# Altium schematic sheet Overview.SchDoc
size A; SheetNumber: 1; SheetTotal: 7
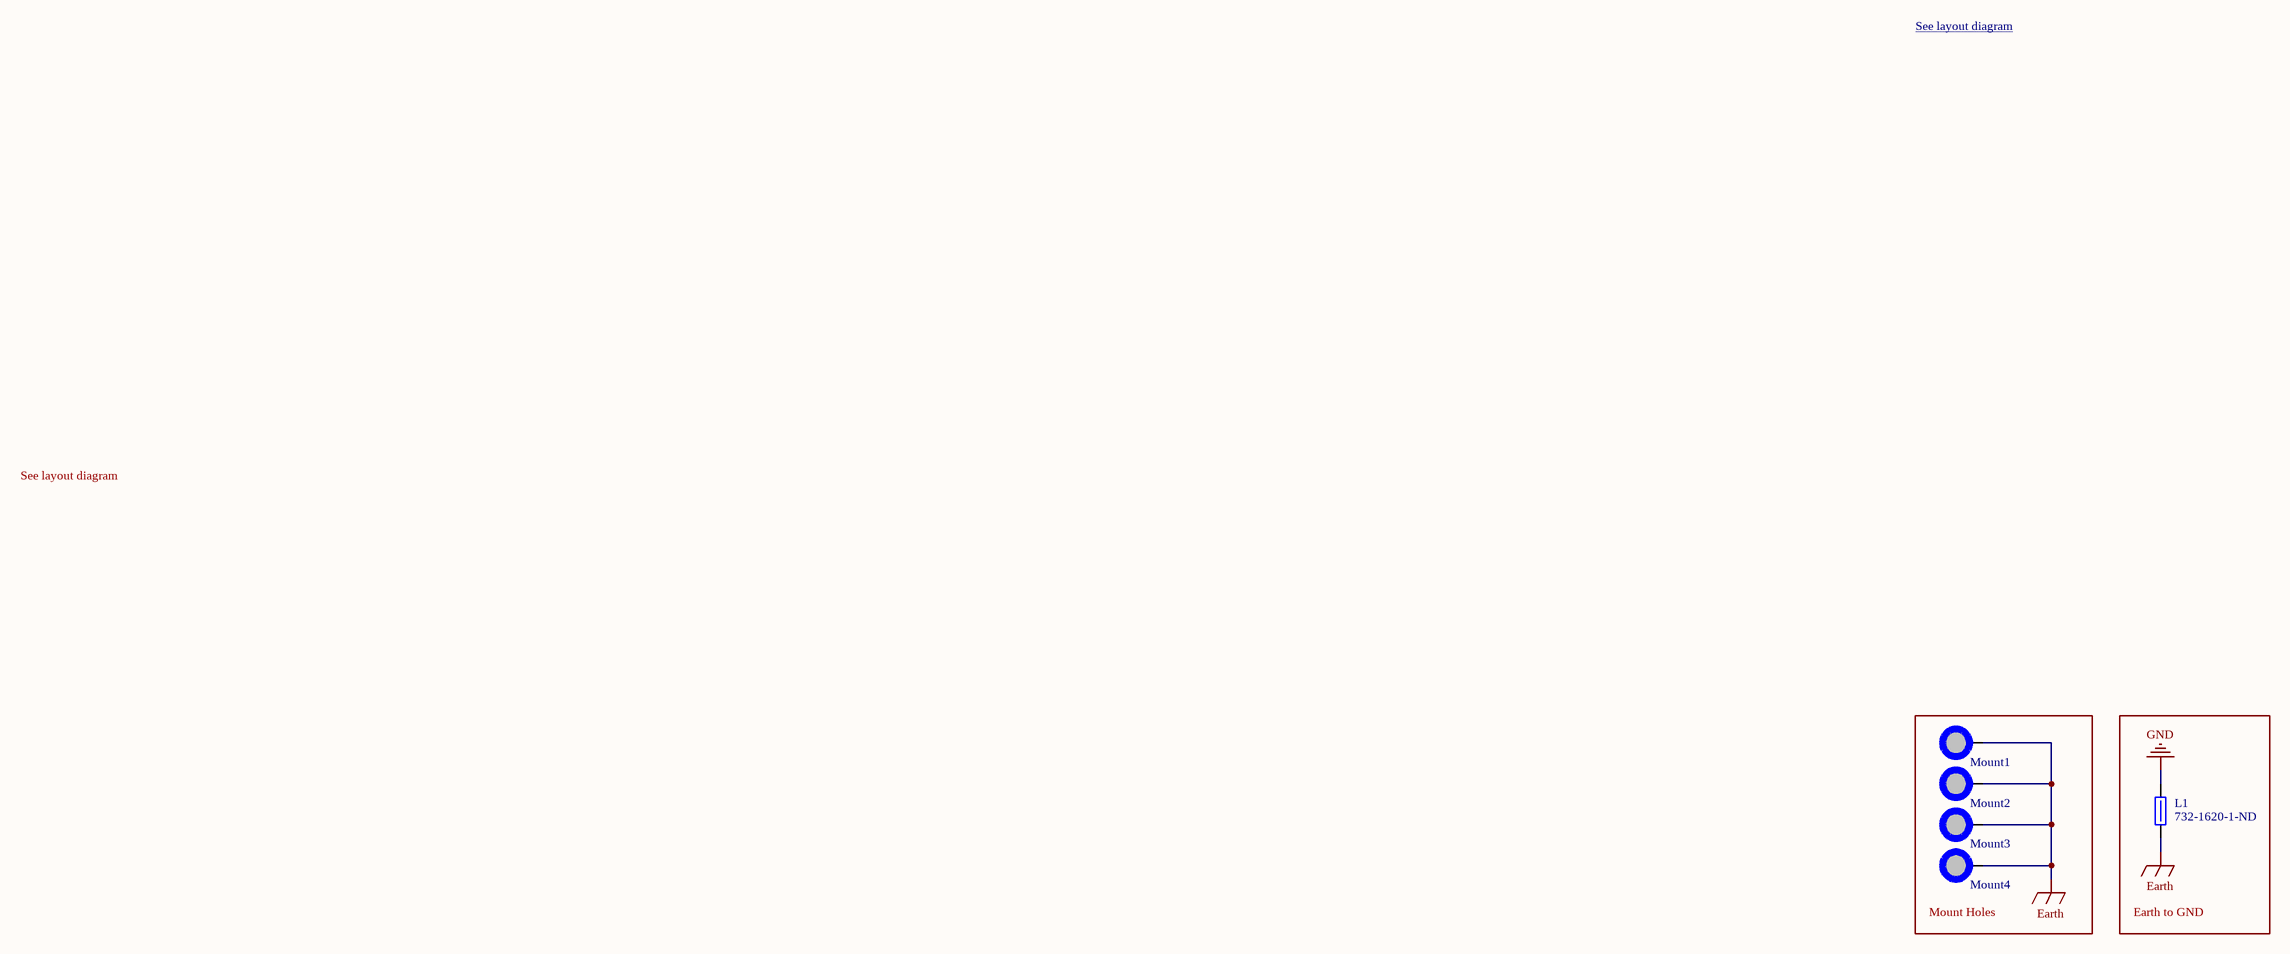
[diagram p0: Overview.SchDoc]

## Parts
L1  Supplier Part Number 1: 732-1620-1-ND  [[Ferrite] SMD Bead 0805 (2)]  (hidden comment: 742792040)
Mount1  M3 Mount Hole  [[Mount] M3 Mount Hole]  (value not drawn)  (no BOM)
Mount2  M3 Mount Hole  [[Mount] M3 Mount Hole]  (value not drawn)  (no BOM)
Mount3  M3 Mount Hole  [[Mount] M3 Mount Hole]  (value not drawn)  (no BOM)
Mount4  M3 Mount Hole  [[Mount] M3 Mount Hole]  (value not drawn)  (no BOM)

## Blocks framed on the sheet
Mount Holes: Mount1-Mount4
Earth to GND: L1

## Nets
Earth: L1.1 Mount1.1 Mount2.1 Mount3.1 Mount4.1
GND: L1.2

## Notes on the sheet
- See layout diagram <https://drive.google.com/file/d/1B1LZ2g49TOjqrB7c7O0v-CyvsEDjMjX-/view?usp=drive_link>
- See layout diagram

## Library data of the parts
L1 = [Ferrite] SMD Ferrite Bead (2): Supplier 1: DigiKey
Mount1-Mount4 = [Mount] M3 Mount Hole: Place at least 4.5mm from board edge. Plated.